# EAGLE schematic SoftStart_V1_0_TO_PRINT (EAGLE 6.1)
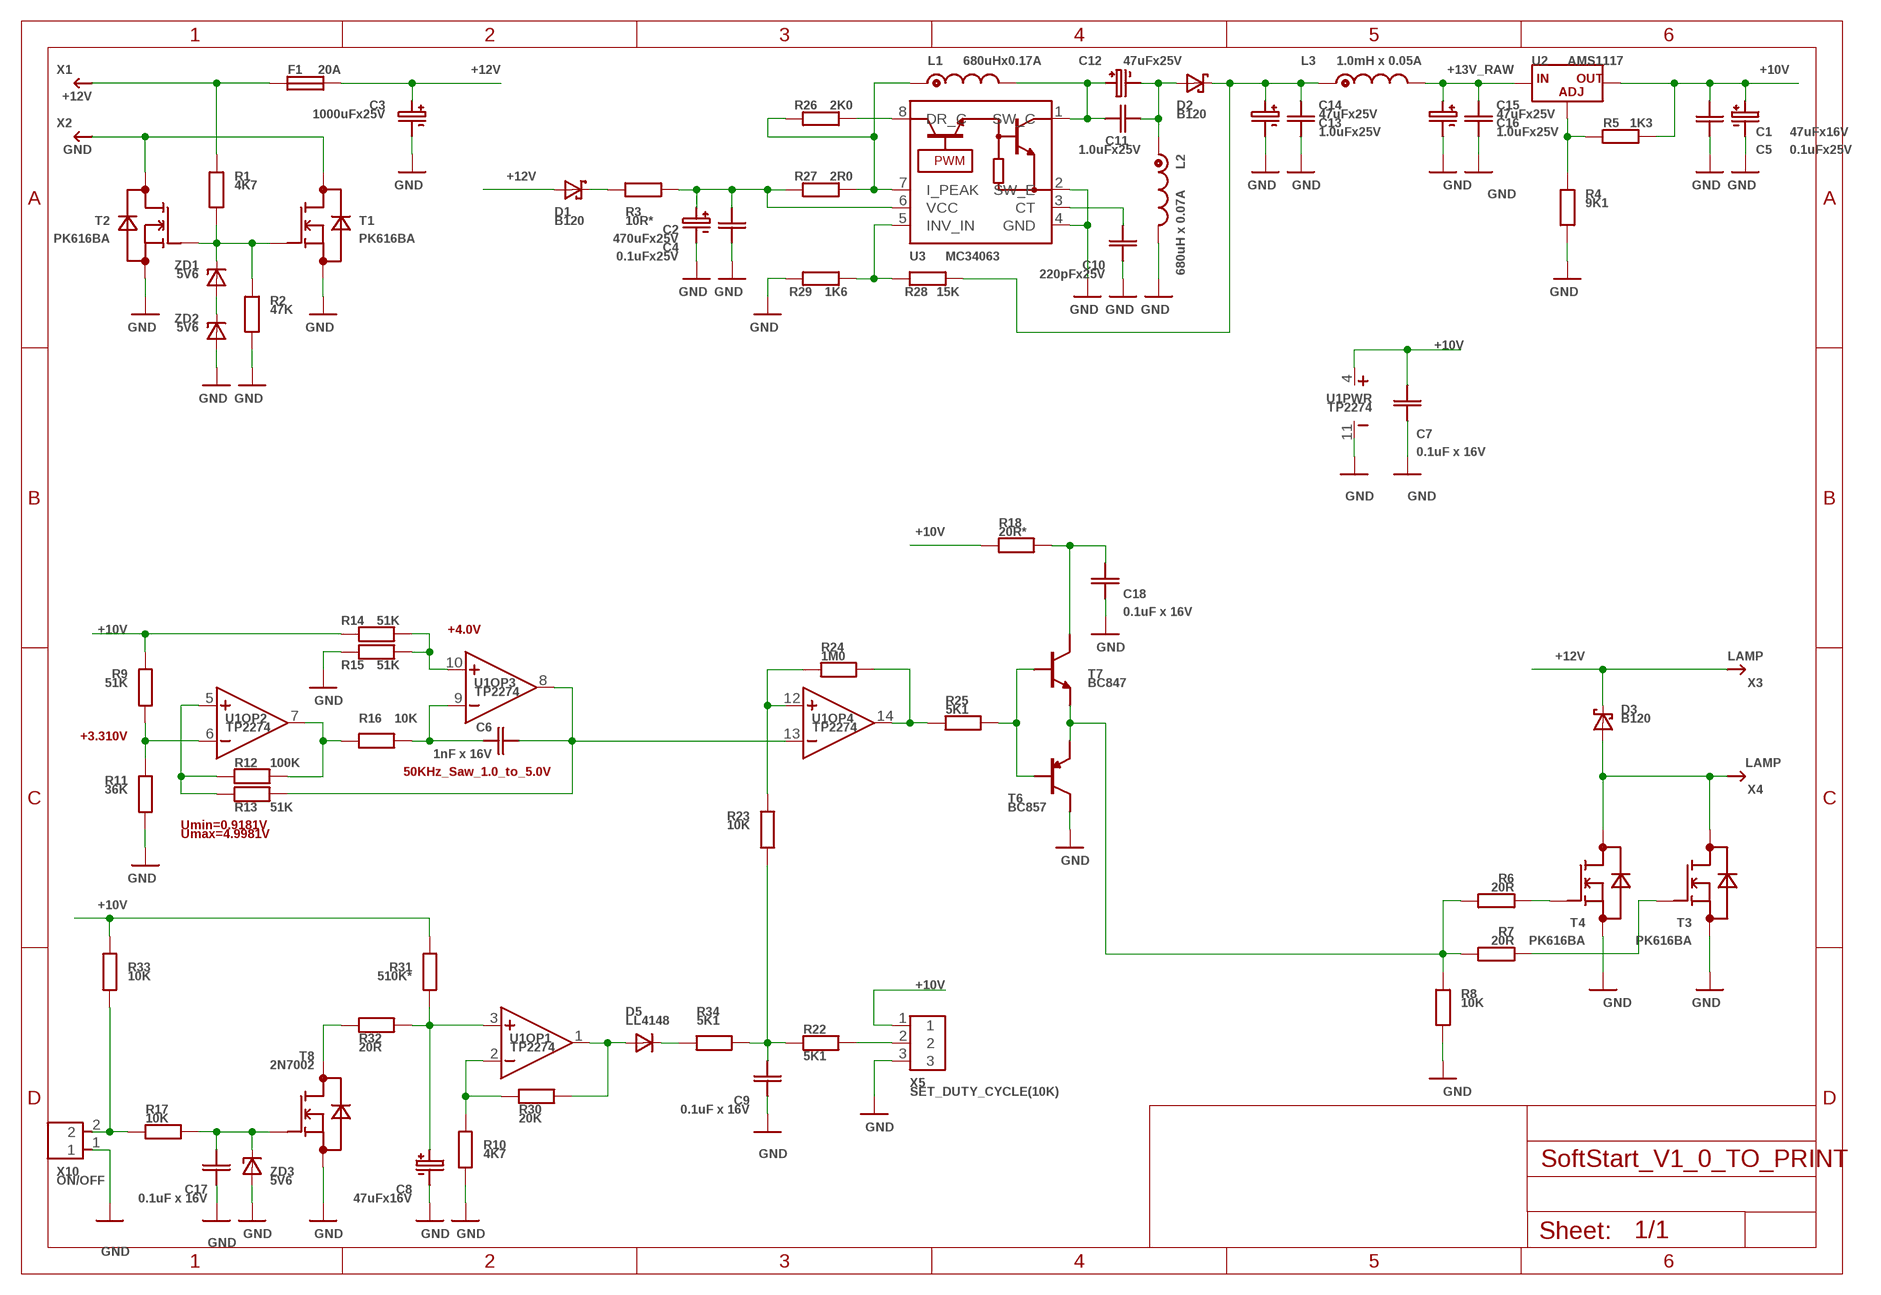
[diagram p0: schematic, sheet 1]

## Parts
C1  47uFx16V  CE6.3MM  [CE_6.3MM]
C2  470uFx25V  CE10MM  [CE_10MM]
C3  1000uFx25V  CE10MM  [CE_10MM]
C4  0.1uFx25V  CSMD_1206  [RSMD_1206]
C5  0.1uFx25V  CSMD_0805  [RSMD_0805]
C6  1nF x 16V  CSMD_0805  [RSMD_0805]
C7  0.1uF x 16V  CSMD_0805  [RSMD_0805]
C8  47uFx16V  CE6.3MM  [CE_6.3MM]
C9  0.1uF x 16V  CSMD_0805  [RSMD_0805]
C10  220pFx25V  CSMD_0805  [RSMD_0805]
C11  1.0uFx25V  CSMD_1206  [RSMD_1206]
C12  47uFx25V  CE6.3MM  [CE_6.3MM]
C13  1.0uFx25V  CSMD_1206  [RSMD_1206]
C14  47uFx25V  CE6.3MM  [CE_6.3MM]
C15  47uFx25V  CE6.3MM  [CE_6.3MM]
C16  1.0uFx25V  CSMD_1206  [RSMD_1206]
C17  0.1uF x 16V  CSMD_0805  [RSMD_0805]
C18  0.1uF x 16V  CSMD_0805  [RSMD_0805]
D1  B120  B120(DO-214AC)  [DO-214AC]
D2  B120  B120(DO-214AC)  [DO-214AC]
D3  B120  B120(DO-214AC)  [DO-214AC]
D5  LL4148  LL4147SOD-80  [SOD-80]
F1  20A  FUSEAUTO_MINI_TERMINALS  [FUSE_AUTO_MINI_ON_TERMINALS]
L1  680uHx0.17A  L(LCHB0608)  [LCHB0608]
L2  680uH x 0.07A  L(LCHB0608)  [LCHB0608]
L3  1.0mH x 0.05A  L(LCHB0608)  [LCHB0608]
R1  4K7  RSMD_0805  [RSMD_0805]
R2  47K  RSMD_0805  [RSMD_0805]
R3  10R*  RSMD_1206_BIG_GAP  [RSMD_1206_BIG_GAP]
R4  9K1  RSMD_0805  [RSMD_0805]
R5  1K3  RSMD_0805  [RSMD_0805]
R6  20R  RSMD_0805  [RSMD_0805]
R7  20R  RSMD_0805  [RSMD_0805]
R8  10K  RSMD_0805  [RSMD_0805]
R9  51K  RSMD_0805  [RSMD_0805]
R10  4K7  RSMD_0805  [RSMD_0805]
R11  36K  RSMD_0805  [RSMD_0805]
R12  100K  RSMD_0805  [RSMD_0805]
R13  51K  RSMD_0805  [RSMD_0805]
R14  51K  RSMD_0805  [RSMD_0805]
R15  51K  RSMD_0805  [RSMD_0805]
R16  10K  RSMD_0805  [RSMD_0805]
R17  10K  RSMD_0805  [RSMD_0805]
R18  20R*  RSMD_1206  [RSMD_1206]
R22  5K1  RSMD_0805  [RSMD_0805]
R23  10K  RSMD_1206_BIG_GAP  [RSMD_1206_BIG_GAP]
R24  1M0  RSMD_0805  [RSMD_0805]
R25  5K1  RSMD_0805  [RSMD_0805]
R26  2K0  RSMD_0805  [RSMD_0805]
R27  2R0  RSMD_1206_BIG_GAP  [RSMD_1206_BIG_GAP]
R28  15K  RSMD_0805  [RSMD_0805]
R29  1K6  RSMD_0805  [RSMD_0805]
R30  20K  RSMD_0805  [RSMD_0805]
R31  510K*  RSMD_0805  [RSMD_0805]
R32  20R  RSMD_0805  [RSMD_0805]
R33  10K  RSMD_0805  [RSMD_0805]
R34  5K1  RSMD_0805  [RSMD_0805]
T1  PK616BA  PK616BA(PDFN_5X6P)  [PDFN_5X6P]
T2  PK616BA  PK616BA(PDFN_5X6P)  [PDFN_5X6P]
T3  PK616BA  PK616BA(PDFN_5X6P)  [PDFN_5X6P]
T4  PK616BA  PK616BA(PDFN_5X6P)  [PDFN_5X6P]
T6  BC857  BC857SOT23  [SOT23]
T7  BC847  BC847SOT23  [SOT23]
T8  2N7002  2N7002SOT23  [SOT23]
U1  TP2274  LM324  [SOIC14]
U2  AMS1117  AMS1117SOT223_WS  [SOT223(WAVE_SOLDERING)]
U3  MC34063  MC34063(SO-8)  [SOIC8]
X1  +12V  RPI_MALE6.3_TWO_HOLES  [RPI_6.3]
X2  GND  RPI_MALE6.3_TWO_HOLES  [RPI_6.3]
X3  LAMP  RPI_MALE6.3_TWO_HOLES  [RPI_6.3]
X4  LAMP  RPI_MALE6.3_TWO_HOLES  [RPI_6.3]
X5  SET_DUTY_CYCLE(10K)  PIN1X3(2.54MM_WITH_CLAMP)  [PIN3X1_2.54MM_WITH_CLAMP]
X10  ON/OFF  PIN1X22.54MM_WITH_CLAMP  [PIN2X1_2.54_WITH_CLAMP]
ZD1  5V6  ZENNER(SOD_80)  [SOD-80]
ZD2  5V6  ZENNER(SOD_80)  [SOD-80]
ZD3  5V6  ZENNER(SOD_80)  [SOD-80]

## Nets
+10V: C1.PLUS C5.PAD_1(PIN1) C7.PAD_1(PIN1) R5.PAD_0(PIN0) R9.PAD_1(PIN1) R14.PAD_1(PIN1) R18.PAD_0(PIN0) R31.PAD_1(PIN1) R33.PAD_1(PIN1) U1.4(PWR:VCC) U2.2(OUT) U2.4(OUT) X5.1
+12V: C3.PLUS D1.ANODE D3.CATHODE F1.PAD0(PIN0) X3.PAD1 X3.PAD2
+13V_RAW: C15.PLUS C16.PAD_0(PIN0) L3.2(END) U2.3(IN)
GND: C1.MINUS C2.MINUS C3.MINUS C4.PAD_0(PIN0) C5.PAD_0(PIN0) C7.PAD_0(PIN0) C8.MINUS C9.PAD_0(PIN0) C10.PAD_0(PIN0) C13.PAD_1(PIN1) C14.MINUS C15.MINUS C16.PAD_1(PIN1) C17.PAD_0(PIN0) C18.PAD_0(PIN0) L2.2(END) R2.PAD_0(PIN0) R4.PAD_0(PIN0) R8.PAD_1(PIN1) R10.PAD_0(PIN0) R11.PAD_0(PIN0) R15.PAD_1(PIN1) R29.PAD_0(PIN0) T1.S1(SOURCE) T1.S2(SOURCE) T1.S3(SOURCE) T2.S1(SOURCE) T2.S2(SOURCE) T2.S3(SOURCE) T3.S1(SOURCE) T3.S2(SOURCE) T3.S3(SOURCE) T4.S1(SOURCE) T4.S2(SOURCE) T4.S3(SOURCE) T6.3(C) T8.2(SOURCE) U1.11(PWR:GND) U3.2(SW_E) U3.4(GND) X5.3 X10.1 ZD2.ANODE ZD3.ANODE
N$1: R1.PAD_0(PIN0) R2.PAD_1(PIN1) T1.G(GATE) T2.G(GATE) ZD1.CATHODE
N$2: T1.D1(DRAIN) T1.D2(DRAIN) T1.D3(DRAIN) T1.D4(DRAIN) T1.D(DRAIN) T2.D1(DRAIN) T2.D2(DRAIN) T2.D3(DRAIN) T2.D4(DRAIN) T2.D(DRAIN) X2.PAD1 X2.PAD2
N$3: ZD1.ANODE ZD2.CATHODE
N$4: F1.PAD1(PIN1) R1.PAD_1(PIN1) X1.PAD1 X1.PAD2
N$5: L1.1(START) R26.PAD_1(PIN1) R27.PAD_0(PIN0) U3.7(I_PEAK)
N$6: D1.CATHODE R3.PAD_1(PIN1)
N$7: R4.PAD_1(PIN1) R5.PAD_1(PIN1) U2.1(ADJ)
N$8: D3.ANODE T3.D1(DRAIN) T3.D2(DRAIN) T3.D3(DRAIN) T3.D4(DRAIN) T3.D(DRAIN) T4.D1(DRAIN) T4.D2(DRAIN) T4.D3(DRAIN) T4.D4(DRAIN) T4.D(DRAIN) X4.PAD1 X4.PAD2
N$9: R7.PAD_0(PIN0) T3.G(GATE)
N$10: R6.PAD_0(PIN0) T4.G(GATE)
N$11: D5.CATHODE R34.PAD_0(PIN0)
N$12: R12.PAD_0(PIN0) R13.PAD_0(PIN0) U1.5(OP2:IN+)
N$13: R12.PAD_1(PIN1) R16.PAD_0(PIN0) U1.7(OP2:OUT)
N$14: R9.PAD_0(PIN0) R11.PAD_1(PIN1) U1.6(OP2:IN-)
N$15: R10.PAD_1(PIN1) R30.PAD_1(PIN1) U1.2(OP1:IN-)
N$16: R14.PAD_0(PIN0) R15.PAD_0(PIN0) U1.10(OP3:IN+)
N$17: C6.PAD_1(PIN1) R16.PAD_1(PIN1) U1.9(OP3:IN-)
N$18: C6.PAD_0(PIN0) R13.PAD_1(PIN1) U1.8(OP3:OUT) U1.13(OP4:IN-)
N$19: D5.ANODE R30.PAD_0(PIN0) U1.1(OP1:OUT)
N$20: C9.PAD_1(PIN1) R22.PAD_1(PIN1) R23.PAD_0(PIN0) R34.PAD_1(PIN1)
N$22: C17.PAD_1(PIN1) R17.PAD_0(PIN0) T8.1(GATE) ZD3.CATHODE
N$23: R22.PAD_0(PIN0) X5.2
N$24: R23.PAD_1(PIN1) R24.PAD_0(PIN0) U1.12(OP4:IN+)
N$25: R24.PAD_1(PIN1) R25.PAD_0(PIN0) U1.14(OP4:OUT)
N$26: R25.PAD_1(PIN1) T6.1(B) T7.1(B)
N$27: R6.PAD_1(PIN1) R7.PAD_1(PIN1) R8.PAD_0(PIN0) T6.2(E) T7.2(E)
N$30: C18.PAD_1(PIN1) R18.PAD_1(PIN1) T7.3(C)
N$31: C11.PAD_1(PIN1) C12.PLUS L1.2(END) U3.1(SW_C)
N$32: C11.PAD_0(PIN0) C12.MINUS D2.ANODE L2.1(START)
N$33: C2.PLUS C4.PAD_1(PIN1) R3.PAD_0(PIN0) R27.PAD_1(PIN1) U3.6(VCC)
N$34: R26.PAD_0(PIN0) U3.8(DR_C)
N$35: C10.PAD_1(PIN1) U3.3(CT)
N$36: C13.PAD_0(PIN0) C14.PLUS D2.CATHODE L3.1(START) R28.PAD_1(PIN1)
N$37: R28.PAD_0(PIN0) R29.PAD_1(PIN1) U3.5(INV_IN)
N$39: R32.PAD_0(PIN0) T8.3(DRAIN)
N$40: C8.PLUS R31.PAD_0(PIN0) R32.PAD_1(PIN1) U1.3(OP1:IN+)
N$41: R17.PAD_1(PIN1) R33.PAD_0(PIN0) X10.2

## Notes on the sheet
- +4.0V
- +3.310V
- 50KHz_Saw_1.0_to_5.0V
- Umin=0.9181V
- Umax=4.9981V

## Library data of the parts
C1-C3 C8 C12 C14 C15 = __MyCommonLib1:CE
C4-C7 C9-C11 C13 C16-C18 = __MyCommonLib1:C
D1-D3 = __MyCommonLib1:B120
D5 = __MyCommonLib1:LL4147
F1 = __MyCommonLib1:FUSE
L1-L3 = __MyCommonLib1:L
R1-R18 R22-R34 = __MyCommonLib1:R
T1-T4 = __MyCommonLib1:PK616BA
T6 = __MyCommonLib1:BC857
T7 = __MyCommonLib1:BC847
T8 = __MyCommonLib1:2N7002
U1 = __MyCommonLib1:LM324
U2 = __MyCommonLib1:AMS1117
U3 = __MyCommonLib1:MC34063
X1-X4 = __MyCommonLib1:RPI_MALE
X5 = __MyCommonLib1:PIN1X3
X10 = __MyCommonLib1:PIN1X2
ZD1-ZD3 = __MyCommonLib1:ZENNER